# Altium schematic sheet Motion Plane.schdoc
size 288 x 198 mm
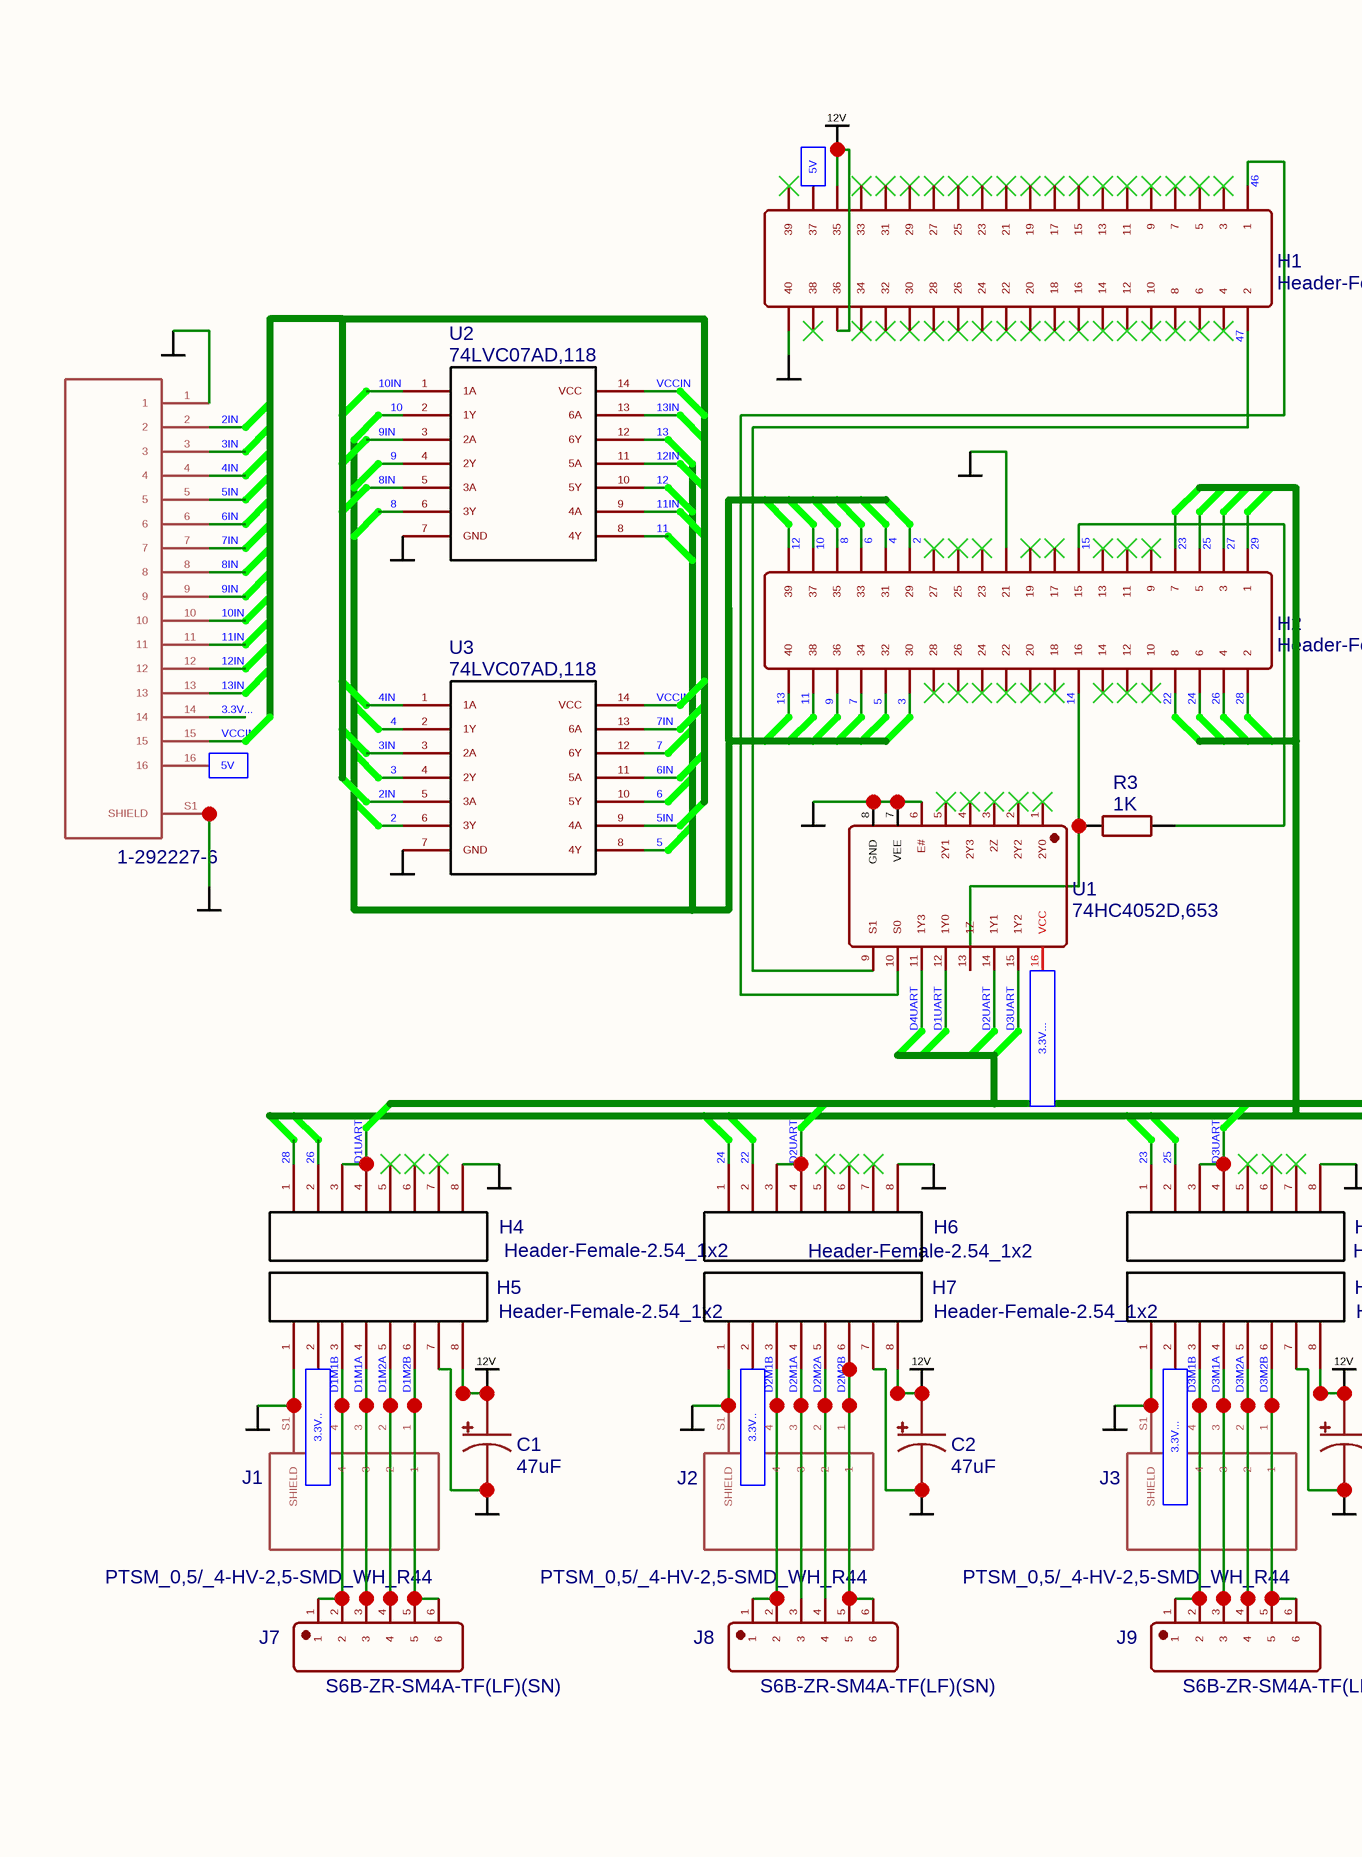
[diagram p0: Motion Plane.schdoc, left]
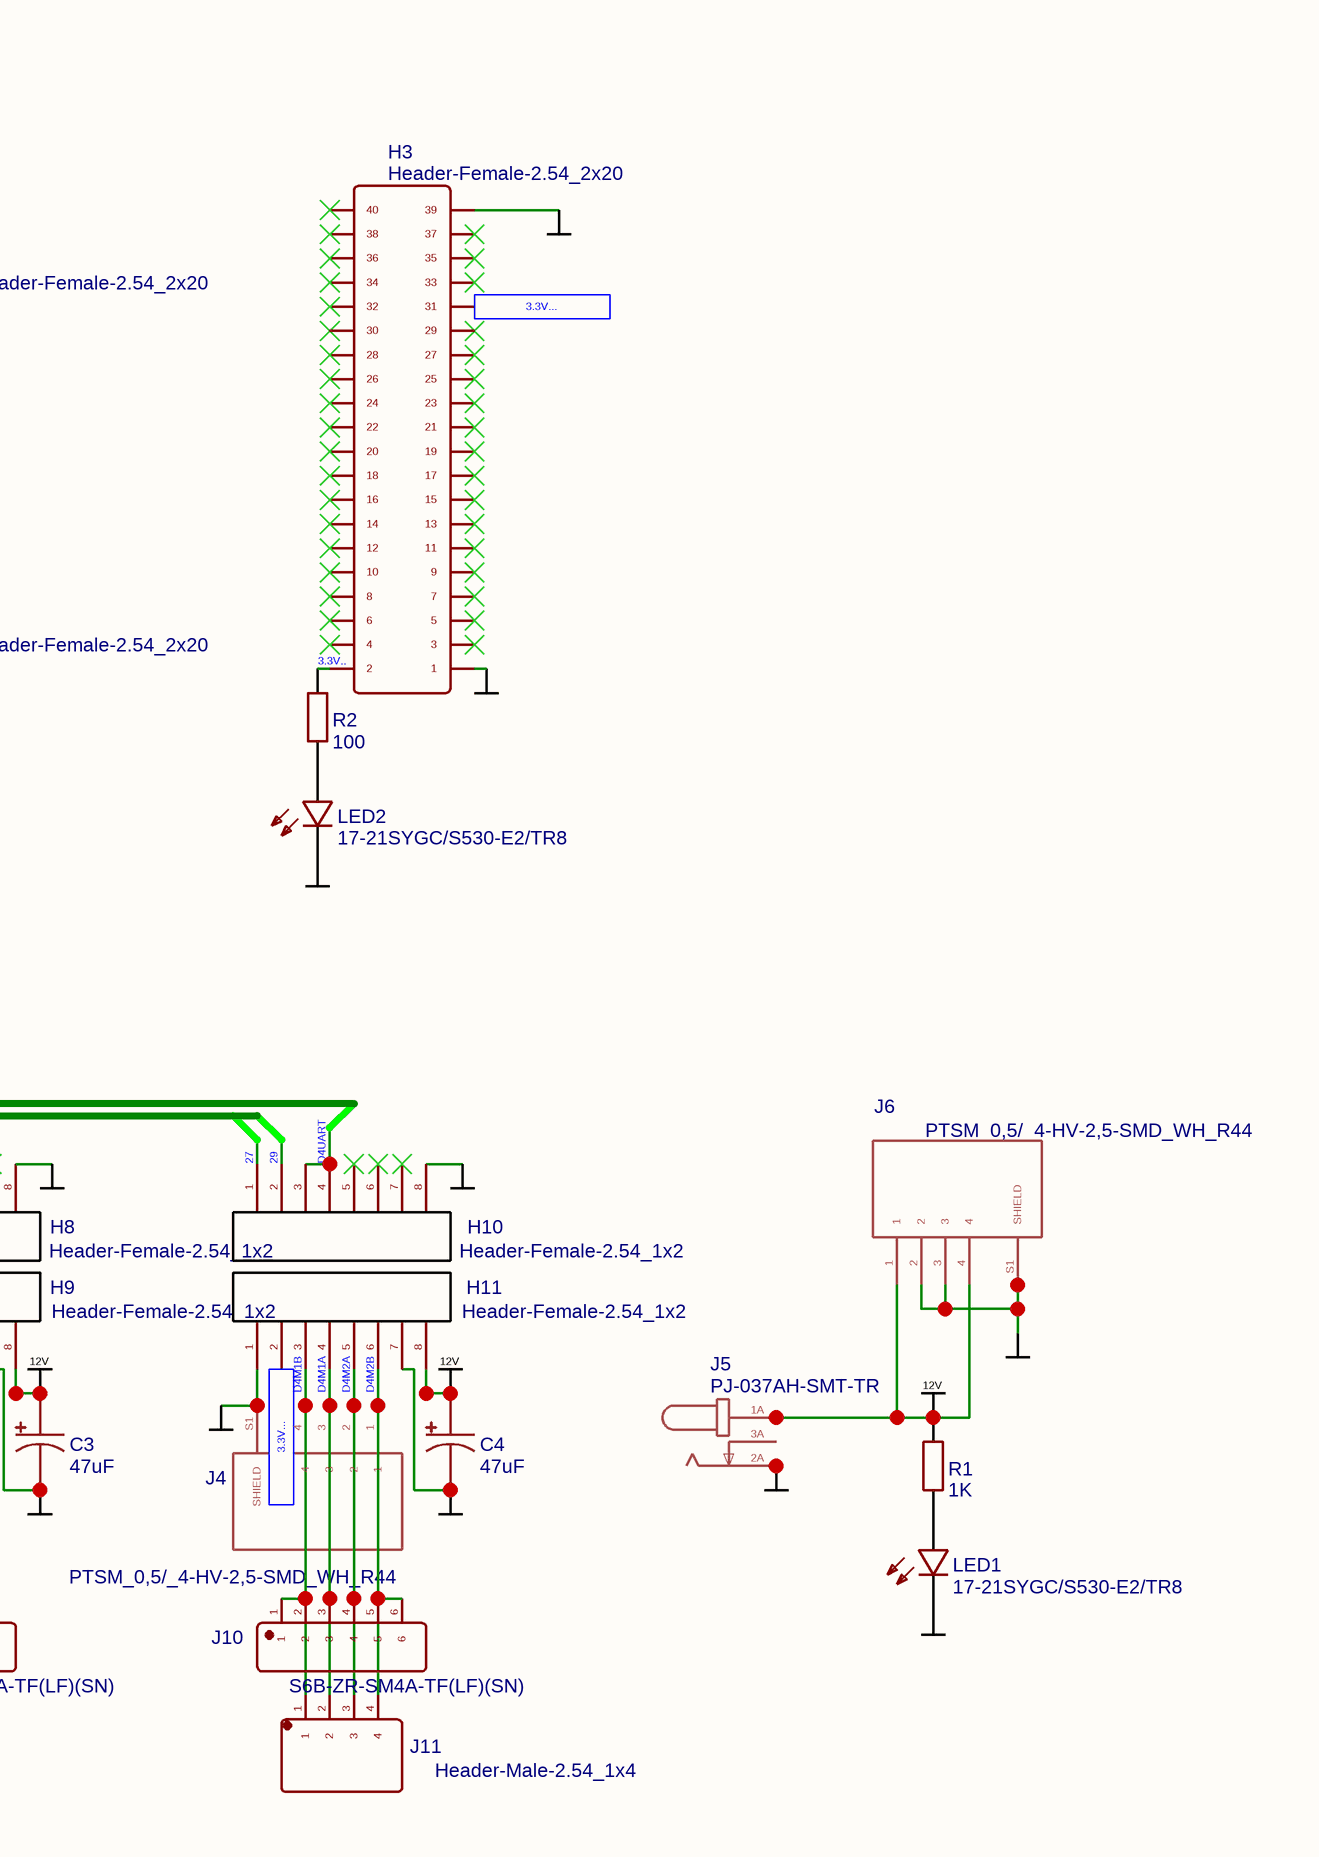
[diagram p1: Motion Plane.schdoc, right]

## Parts
C1  47uF  [CAP-SMD_BD6.3-L6.6-W6.6-FD]
C2  47uF  [CAP-SMD_BD6.3-L6.6-W6.6-FD]
C3  47uF  [CAP-SMD_BD6.3-L6.6-W6.6-FD]
C4  47uF  [CAP-SMD_BD6.3-L6.6-W6.6-FD]
H1  Header-Female-2.54_2x20  [HDR-TH_40P-P2.54-V-R2-C20-S2.54]
H2  Header-Female-2.54_2x20  [HDR-TH_40P-P2.54-V-R2-C20-S2.54]
H3  Header-Female-2.54_2x20  [HDR-TH_40P-P2.54-V-R2-C20-S2.54]
H4  Header-Female-2.54_1x2  [NPPC081KFXC-RC]
H5  Header-Female-2.54_1x2  [NPPC081KFXC-RC]
H6  Header-Female-2.54_1x2  [NPPC081KFXC-RC]
H7  Header-Female-2.54_1x2  [NPPC081KFXC-RC]
H8  Header-Female-2.54_1x2  [NPPC081KFXC-RC]
H9  Header-Female-2.54_1x2  [NPPC081KFXC-RC]
H10  Header-Female-2.54_1x2  [NPPC081KFXC-RC]
H11  Header-Female-2.54_1x2  [NPPC081KFXC-RC]
J1  PTSM_0,5/_4-HV-2,5-SMD_WH_R44  [PHOENIX_PTSM_0,5/_4-HV-2,5-SMD_WH_R44]
J2  PTSM_0,5/_4-HV-2,5-SMD_WH_R44  [PHOENIX_PTSM_0,5/_4-HV-2,5-SMD_WH_R44]
J3  PTSM_0,5/_4-HV-2,5-SMD_WH_R44  [PHOENIX_PTSM_0,5/_4-HV-2,5-SMD_WH_R44]
J4  PTSM_0,5/_4-HV-2,5-SMD_WH_R44  [PHOENIX_PTSM_0,5/_4-HV-2,5-SMD_WH_R44]
J5  PJ-037AH-SMT-TR  [CUI_PJ-037AH-SMT-TR]
J6  PTSM_0,5/_4-HV-2,5-SMD_WH_R44  [PHOENIX_PTSM_0,5/_4-HV-2,5-SMD_WH_R44]
J7  S6B-ZR-SM4A-TF(LF)(SN)  [CONN-SMD_S6B-ZR-SM4A-TF]
J8  S6B-ZR-SM4A-TF(LF)(SN)  [CONN-SMD_S6B-ZR-SM4A-TF]
J9  S6B-ZR-SM4A-TF(LF)(SN)  [CONN-SMD_S6B-ZR-SM4A-TF]
J10  S6B-ZR-SM4A-TF(LF)(SN)  [CONN-SMD_S6B-ZR-SM4A-TF]
J11  Header-Male-2.54_1x4  [DIP-1X4P-2.54MM-M]
LED1  17-21SYGC/S530-E2/TR8  [LED0805-RD]
LED2  17-21SYGC/S530-E2/TR8  [LED0805-RD]
NO1  1-292227-6  [TE_1-292227-6]
R1  1K  [R1206]
R2  100  [R1206]
R3  1K  [R1206]
U1  74HC4052D,653  [SOIC-16_L9.9-W3.9-P1.27-LS6.0-BL]
U2  74LVC07AD,118  [SOIC-14_L8.7-W3.9-P1.27-LS6.0-BL]
U3  74LVC07AD,118  [SOIC-14_L8.7-W3.9-P1.27-LS6.0-BL]

## Ports
3.3V.. (in), 3.3V... (in), 5V (in)

## Nets
12V: C1.1 C2.1 C3.1 C4.1 H1.35 H1.36 H5.8 H7.8 H9.8 H11.8 J5.1A J5.1B J6.1 J6.4 R1.2
GND: C1.2 C2.2 C3.2 C4.2 H1.40 H2.21 H3.1 H3.39 H4.8 H5.1 H5.7 H6.8 H7.1 H7.7 H8.8 H9.1 H9.7 H10.8 H11.1 H11.7 J1.S1(SHIELD) J1.S2(SHIELD) J2.S1(SHIELD) J2.S2(SHIELD) J3.S1(SHIELD) J3.S2(SHIELD) J4.S1(SHIELD) J4.S2(SHIELD) J5.2A J5.2B J6.2 J6.3 J6.S1(SHIELD) J6.S2(SHIELD) LED1.1(-) LED2.1(-) NO1.1 NO1.S1(SHIELD) NO1.S2(SHIELD) U1.6(E#) U1.7(VEE) U1.8(GND) U2.7(GND) U3.7(GND)
2: H2.29 U3.6(3Y)
2IN: NO1.2 U3.5(3A)
3: H2.30 U3.4(2Y)
3.3V..: H3.2 R2.2
3.3V..: H5.2 H7.2 ; port 3.3V..  [a separate net that carries the same name]
3.3V...: H3.31 H9.2 H11.2 U1.16(VCC) ; port 3.3V...
3.3V...: NO1.14  [a separate net that carries the same name]
3IN: NO1.3 U3.3(2A)
4: H2.31 U3.2(1Y)
4IN: NO1.4 U3.1(1A)
5: H2.32 U3.8(4Y)
5IN: NO1.5 U3.9(4A)
5V: H1.37 NO1.16 ; port 5V
6: H2.33 U3.10(5Y)
6IN: NO1.6 U3.11(5A)
7: H2.34 U3.12(6Y)
7IN: NO1.7 U3.13(6A)
8: H2.35 U2.6(3Y)
8IN: NO1.8 U2.5(3A)
9: H2.36 U2.4(2Y)
9IN: NO1.9 U2.3(2A)
10: H2.37 U2.2(1Y)
10IN: NO1.10 U2.1(1A)
11: H2.38 U2.8(4Y)
11IN: NO1.11 U2.9(4A)
12: H2.39 U2.10(5Y)
12IN: NO1.12 U2.11(5A)
13: H2.40 U2.12(6Y)
13IN: NO1.13 U2.13(6A)
14: H2.16 R3.2 U1.13(1Z)
15: H2.15 R3.1
22: H2.8 H6.2
23: H2.7 H8.1
24: H2.6 H6.1
25: H2.5 H8.2
26: H2.4 H4.2
27: H2.3 H10.1
28: H2.2 H4.1
29: H2.1 H10.2
46: H1.1 U1.10(S0)
47: H1.2 U1.9(S1)
D1M1A: H5.4 J1.3 J7.3
D1M1B: H5.3 J1.4 J7.1 J7.2
D1M2A: H5.5 J1.2 J7.4
D1M2B: H5.6 J1.1 J7.5 J7.6
D1UART: H4.3 H4.4 U1.12(1Y0)
D2M1A: H7.4 J2.3 J8.3
D2M1B: H7.3 J2.4 J8.1 J8.2
D2M2A: H7.5 J2.2 J8.4
D2M2B: H7.6 J2.1 J8.5 J8.6
D2UART: H6.3 H6.4 U1.14(1Y1)
D3M1A: H9.4 J3.3 J9.3
D3M1B: H9.3 J3.4 J9.1 J9.2
D3M2A: H9.5 J3.2 J9.4
D3M2B: H9.6 J3.1 J9.5 J9.6
D3UART: H8.3 H8.4 U1.15(1Y2)
D4M1A: H11.4 J4.3 J10.3 J11.2
D4M1B: H11.3 J4.4 J10.1 J10.2 J11.1
D4M2A: H11.5 J4.2 J10.4 J11.3
D4M2B: H11.6 J4.1 J10.5 J10.6 J11.4
D4UART: H10.3 H10.4 U1.11(1Y3)
VCCIN: NO1.15 U2.14(VCC) U3.14(VCC)
NetJ5_3A: J5.3A J5.3B
NetLED1_2: LED1.2(+) R1.1
NetLED2_2: LED2.2(+) R2.1

Not connected (* = marked no-connect by the designer): H1 3* 4* 5* 6* 7* 8* 9* 10* 11* 12* 13* 14* 15* 16* 17* 18* 19* 20* 21* 22* 23* 24* 25* 26* 27* 28* 29* 30* 31* 32* 33* 34* 38* 39*; H2 9* 10* 11* 12* 13* 14* 17* 18* 19* 20* 22* 23* 24* 25* 26* 27* 28*; H3 3* 4* 5* 6* 7* 8* 9* 10* 11* 12* 13* 14* 15* 16* 17* 18* 19* 20* 21* 22* 23* 24* 25* 26* 27* 28* 29* 30* 32* 33* 34* 35* 36* 37* 38* 40*; H4 5* 6* 7*; H6 5* 6* 7*; H8 5* 6* 7*; H10 5* 6* 7*; U1 1(2Y0)* 2(2Y2)* 3(2Z)* 4(2Y3)* 5(2Y1)*

## Library data of the parts
C1-C4 = 47uF: BOM_Manufacturer: Nichicon; BOM_Manufacturer Part: UCD1E470MCL1GS; nameAlias: Capacitance; Contributor: LCSC; BOM_Description: 47µF 25V Aluminum Electrolytic Capacitors Radial, Can - SMD  2000 Hrs @ 105°C; BOM_Supplier: LCSC; BOM_Supplier Part: C308827; spicePre: C; spiceSymbolName: UCD1E470MCL1GS; BOM_Link: https://www.digikey.com/product-detail/en/nichicon/UCD1E470MCL1GS/493-6385-1-ND/3438899; BOM_Image: https://media.digikey.com/Photos/Nichicon%20Photos/CD%20Series%206.10mm.jpg
H1-H3 = Header-Female-2.54_2x20: BOM_Manufacturer: Pololu; BOM_Manufacturer Part: 2749; BOM_Description: Stackable 0.100″ Female Header with Extra 0.3″ Spacer: 2x20-Pin, Straight; BOM_Supplier: Pololu; BOM_Supplier Part: 2749; spicePre: P; spiceSymbolName: Header-Female-2.54_2x20; BOM_Link: https://www.pololu.com/product/2749; BOM_Image: https://a.pololu-files.com/picture/0J5966.1200.jpg?26e92f39ef46f99e5d642f9fa718b551
H4-H11 = Header-Female-2.54_1x2: BOM_Manufacturer: Sullins Connector Solutions; BOM_Manufacturer Part: S5639-ND; Contributor: travisbavar; BOM_Description: 8 Position Header, Top or Bottom Entry Connector  Surface Mount; BOM_Supplier: Digi-Key; BOM_Supplier Part: NPPC081KFXC-RC; spicePre: J; spiceSymbolName: Connector_8; BOM_Link: https://www.digikey.com/product-detail/en/sullins-connector-solutions/NPPC081KFXC-RC/S5639-ND/776098; BOM_Image: https://media.digikey.com/photos/Sullins%20Photos/NPPC081KFXC-RC.jpg
J1-J4 J6 = PTSM_0,5/_4-HV-2,5-SMD_WH_R44: BOM_Manufacturer Part: 1814650; BOM_Manufacturer: Phoenix Contact; Contributor: karim ziadi; BOM_Description: SSL Connector 4 Position Receptacle, Poke-In Wire Board to Cable/Wire 0.098" (2.50mm) Solder; spicePre: J; spiceSymbolName: PTSM_0,5/_4-HV-2,5-SMD_WH_R44; BOM_Supplier: Digi-Key; BOM_Supplier Part: 277-10064-1-ND; BOM_Link: https://www.digikey.com/product-detail/en/phoenix-contact/1814650/277-10064-1-ND/4738862; BOM_Image: https://media.digikey.com/Photos/Phoenix%20Photos/1814650.JPG
J5 = PJ-037AH-SMT-TR: BOM_Manufacturer: CUI Devices; Contributor: Ethan Li; BOM_Description: Power Barrel Connector Jack 2.10mm ID (0.083"), 5.50mm OD (0.217") Surface Mount, Right Angle; Through Hole; spicePre: J; spiceSymbolName: PJ-037AH-SMT-TR; BOM_Manufacturer Part: PJ-037AH-SMT-TR; BOM_Supplier Part: CP-037AHPJCT-ND; BOM_Supplier: Digi-Key; BOM_Link: https://www.digikey.com/product-detail/en/cui-devices/PJ-037AH-SMT-TR/CP-037AHPJCT-ND/1530998; BOM_Image: https://media.digikey.com/photos/CUI%20Photos/MFG_PJ-037AH-SMT.jpg
J7-J10 = S6B-ZR-SM4A-TF(LF)(SN): BOM_Manufacturer: JST Sales America; Contributor: LCSC; BOM_Description: Connector Header Surface Mount, Right Angle 6 position 0.059" (1.50mm); BOM_Supplier: LCSC; BOM_Supplier Part: C265070; BOM_Manufacturer Part: S6B-ZR-SM4A-TF(LF)(SN); spicePre: C; spiceSymbolName: S6B-ZR-SM4A-TF(LF)(SN); BOM_Link: https://www.digikey.com/product-detail/en/jst-sales-america-inc/S6B-ZR-SM4A-TF-LF-SN/455-1610-1-ND/858041; BOM_Image: https://media.digikey.com/photos/JST%20Photos/S6B-ZR-SM3A-TF.jpg
J11 = Header-Male-2.54_1x4: BOM_Manufacturer: Molex; BOM_Manufacturer Part: 22292041; Contributor: LCSC; BOM_Description: Connector Header Through Hole 4 position 0.100" (2.54mm); BOM_Supplier: Digi-Key; BOM_Supplier Part: WM2746-ND; spicePre: H; spiceSymbolName: Header-Male-2.54_1x4; BOM_Link: https://www.digikey.com/product-detail/en/molex/0022292041/WM2746-ND/1130590; BOM_Image: https://media.digikey.com/Photos/Molex/0022292041.jpg
LED1 LED2 = 17-21SYGC/S530-E2/TR8: BOM_Manufacturer: EVERLIGHT; SMT Type: Extend; BOM_Description: Yellow-Green 573nm LED Indication - Discrete 2V 0805 (2012 Metric); BOM_Supplier: LCSC; BOM_Manufacturer Part: 17-21SYGC/S530-E2/TR8; BOM_Supplier Part: C73548; BOM_LCSC Assembly: Yes; spicePre: L; spiceSymbolName: 17-21SYGC/S530-E2/TR8; BOM_Link: https://www.digikey.com/product-detail/en/everlight-electronics-co-ltd/17-21SYGC-S530-E2-TR8/1080-1500-1-ND/7707772; BOM_Image: https://media.digikey.com/Photos/Everlight%20Electronics/MFG_17-21SYGC%5ES530-E2%5ETR8.jpg
NO1 = 1-292227-6: BOM_Manufacturer: TE Connectivity; Contributor: Ethan Li; BOM_Description: AMP Mini CT, PCB Mount Header, Right Angle, Wire-to-Board, 16 Position, 1.5mm [.059in] Centerline, 1 Row, Pre-Tin, Natural, Shrouded; BOM_Supplier: Digi-Key; BOM_Supplier Part: A99782CT-ND; BOM_Manufacturer Part: 1-292227-6; BOM_Link: https://www.te.com/usa-en/product-1-292227-6.html; BOM_Image: https://https://www.te.com/content/dam/te-com/catalog/part/012/922/276/1-292227-6-t1.jpg/jcr:content/renditions/product-details.png; spicePre: C; spiceSymbolName: TE AMP Mini CT 1-292227-6
R1 R3 = 1K: BOM_Manufacturer: YAGEO; BOM_Manufacturer Part: RC1206FR-071KL; nameAlias: Resistance (Ohms); BOM_Description: 1 kOhms ±1% 0.25W, 1/4W Chip Resistor 1206 (3216 Metric) Moisture Resistant Thick Film; BOM_Supplier: LCSC; BOM_Supplier Part: C131398; spicePre: R; spiceSymbolName: RC1206FR-071KL; BOM_Link: https://www.digikey.com/product-detail/en/%E5%9E%88-%C3%A1/RC1206FR-071KL/311-1-00KFRCT-ND/731334; BOM_Image: https://media.digikey.com/Renders/Yageo%20Renders/1206-(3216-Metric).jpg
R2 = 100: BOM_Manufacturer: YAGEO; BOM_Manufacturer Part: RC1206FR-07100RL; nameAlias: Resistance (Ohms); BOM_Description: 100 Ohms ±1% 0.25W, 1/4W Chip Resistor 1206 (3216 Metric) Moisture Resistant Thick Film; BOM_Supplier: LCSC; BOM_Supplier Part: C137392; spicePre: R; spiceSymbolName: RC1206FR-07100RL; BOM_Link: https://www.digikey.com/product-detail/en/%E5%9E%88-%C3%A1/RC1206FR-07100RL/311-100FRCT-ND/731438; BOM_Image: https://media.digikey.com/Renders/Yageo%20Renders/1206-(3216-Metric).jpg
U1 = 74HC4052D,653: BOM_Manufacturer: Nexperia; SMT Type: Extend; BOM_Description: 2 Circuit IC Switch 4:1 150Ohm 16-SO; spicePre: X; BOM_Supplier: LCSC; BOM_Manufacturer Part: 74HC4052D,653; BOM_Supplier Part: C11350; BOM_LCSC Assembly: Yes; spiceSymbolName: 74HC4052D,653; BOM_Image: https://media.digikey.com/Photos/Nexperia/MFG_SO16_SOT109-1.jpg; BOM_Link: https://www.digikey.com/product-detail/en/nexperia-usa-inc/74HC4052D-653/1727-2808-1-ND/763388
U2 U3 = 74LVC07AD,118: BOM_Manufacturer: Nexperia; SMT Type: Extend; BOM_Description: Buffer, Non-Inverting 6 Element 1 Bit per Element Open Drain Output 14-SO; BOM_Supplier: LCSC; BOM_Manufacturer Part: 74LVC07AD,118; BOM_Supplier Part: C6049; BOM_LCSC Assembly: Yes; spicePre: U; spiceSymbolName: 74LVC07AD,118; BOM_Link: https://www.digikey.com/product-detail/en/nexperia-usa-inc/74LVC07AD-118/1727-3089-1-ND/946746; BOM_Image: https://media.digikey.com/Renders/NXP%20Semi%20Renders/14-SOIC-SOT108-1.jpg